# Altium schematic sheet mpc56_cwconn.SchDoc: CW308 UFO Connectors
size Letter; Organization: NewAE Technology Inc.; Address1: 1083 Queen St., Suite 196; Address2: Halifax; Address3: NS; Address4: Canada B3H 0B2; SheetNumber: 4; SheetTotal: 5; SheetApproved: YES
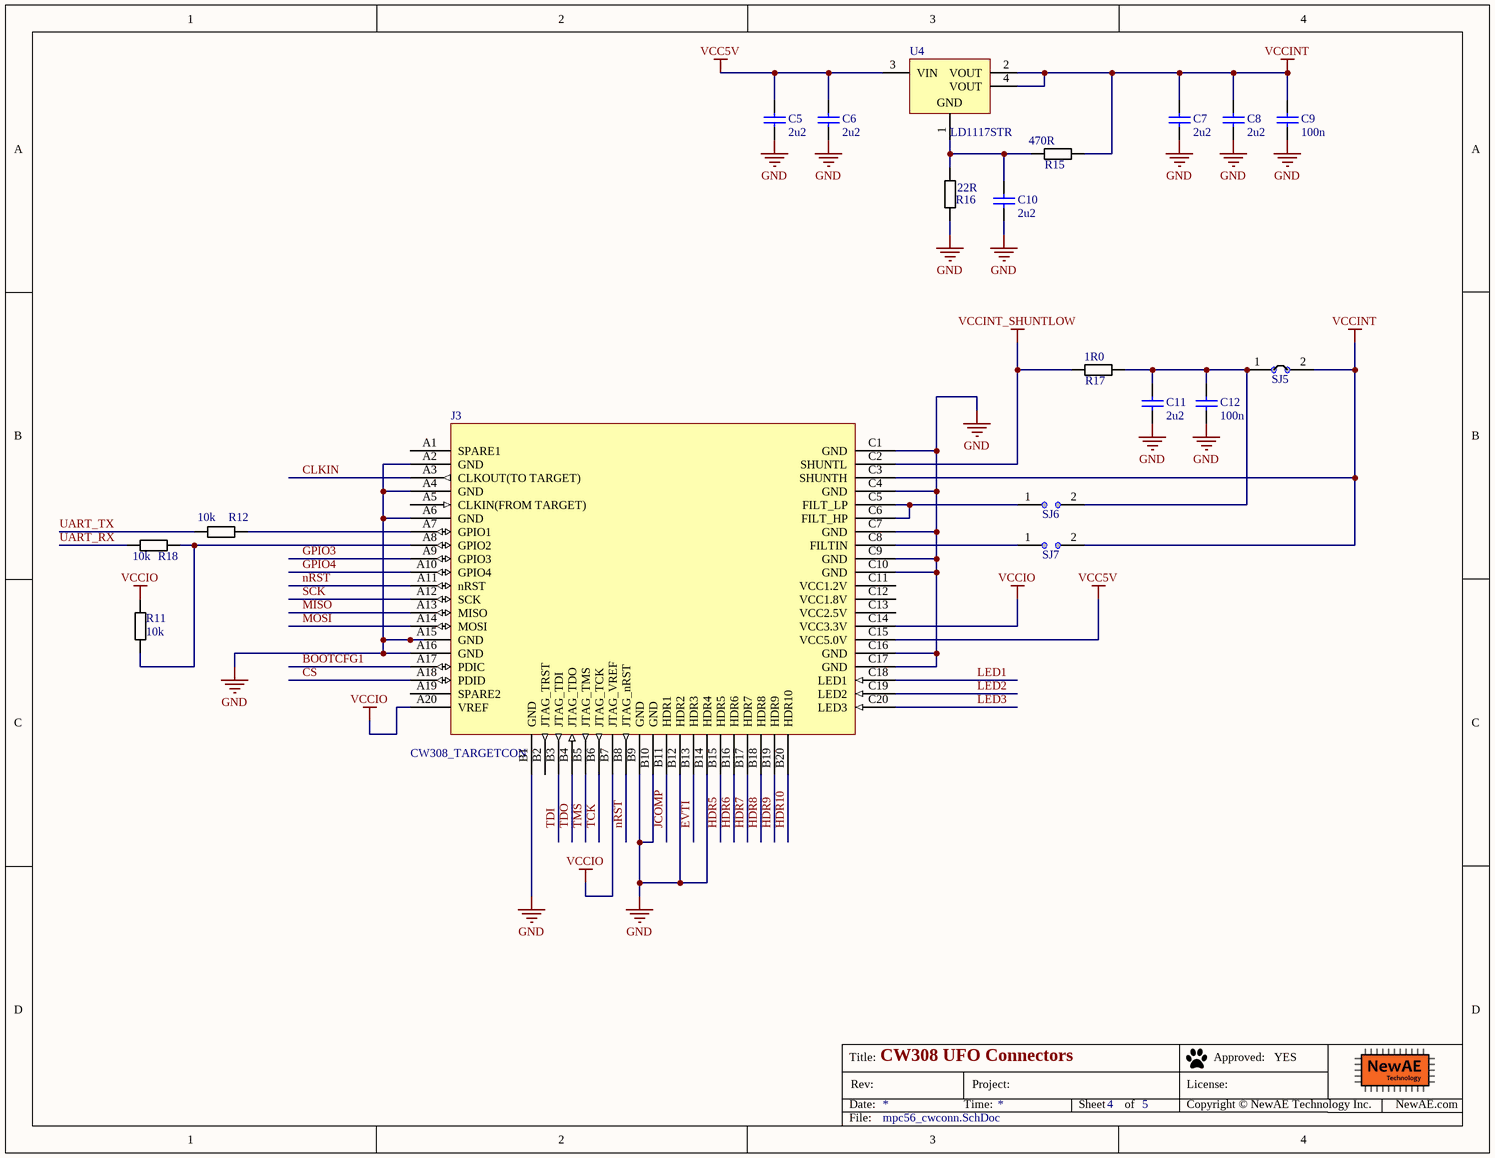
[diagram p0: mpc56_cwconn.SchDoc]

## Parts
C5  2u2  [CAPC0603_M]
C6  2u2  [CAPC0603_M]
C7  2u2  [CAPC0603_M]
C8  2u2  [CAPC0603_M]
C9  100n  [CAPC0402_M]
C10  2u2  [CAPC0603_M]
C11  2u2  [CAPC0603_M]
C12  100n  [CAPC0402_M]
J3  CW308_TARGETCON  [CW308_TBOARD_CONN]
R11  10k  [RESC1608X55N]
R12  10k  [RESC1608X55N]
R15  470R  [RESC1608X55N]
R16  22R  [RESC1608X55N]
R17  1R0  [RESC2012X70N]
R18  10k  [RESC1608X55N]
SJ5  NC  [SJ_2S_NC]  (value not drawn)  (no BOM)
SJ6  NO  [SJ_2S_NO]  (value not drawn)  (no BOM)
SJ7  NO  [SJ_2S_NO]  (value not drawn)  (no BOM)
U4  LD1117STR  [SOT-223_L]

## Nets
GND: C5.2 C6.2 C7.2 C8.2 C9.2 C10.2 C11.2 C12.2 J3.A2(GND) J3.A4(GND) J3.A6(GND) J3.A15(GND) J3.A16(GND) J3.B1(GND) J3.B9(GND) J3.B10(GND) J3.B12(HDR2) J3.B14(HDR4) J3.C1(GND) J3.C4(GND) J3.C7(GND) J3.C9(GND) J3.C10(GND) J3.C16(GND) J3.C17(GND) R16.2
VCC5V: C5.1 C6.1 J3.C15(VCC5.0V) U4.3(VIN)
VCCINT: C7.1 C8.1 C9.1 J3.C3(SHUNTH) R15.1 SJ5.2 SJ7.2 U4.2(VOUT) U4.4(VOUT)
VCCINT_SHUNTLOW: J3.C2(SHUNTL) R17.1
VCCIO: J3.A20(VREF) J3.B7(JTAG_VREF) J3.C14(VCC3.3V) R11.2
BOOTCFG1: J3.A17(PDIC)
CLKIN: J3.A3(CLKOUT(TO_TARGET))
CS: J3.A18(PDID)
EVTI: J3.B13(HDR3)
GPIO3: J3.A9(GPIO3)
GPIO4: J3.A10(GPIO4)
HDR5: J3.B15(HDR5)
HDR6: J3.B16(HDR6)
HDR7: J3.B17(HDR7)
HDR8: J3.B18(HDR8)
HDR9: J3.B19(HDR9)
HDR10: J3.B20(HDR10)
JCOMP: J3.B11(HDR1)
LED1: J3.C18(LED1)
LED2: J3.C19(LED2)
LED3: J3.C20(LED3)
MISO: J3.A13(MISO)
MOSI: J3.A14(MOSI)
nRST: J3.A11(nRST) J3.B8(JTAG_nRST)
SCK: J3.A12(SCK)
TCK: J3.B6(JTAG_TCK)
TDI: J3.B3(JTAG_TDI)
TDO: J3.B4(JTAG_TDO)
TMS: J3.B5(JTAG_TMS)
UART_RX: R18.1
UART_TX: R12.1
NetC10_1: C10.1 R15.2 R16.1 U4.1(GND)
NetC11_1: C11.1 C12.1 R17.2 SJ5.1 SJ6.2
NetJ3_A7: J3.A7(GPIO1) R12.2
NetJ3_A8: J3.A8(GPIO2) R11.1 R18.2
NetJ3_C5: J3.C5(FILT_LP) J3.C6(FILT_HP) SJ6.1
NetJ3_C8: J3.C8(FILTIN) SJ7.1

Not connected (* = marked no-connect by the designer): J3 A1(SPARE1) A5(CLKIN(FROM_TARGET)) A19(SPARE2) B2(JTAG_TRST) C11(VCC1.2V) C12(VCC1.8V) C13(VCC2.5V)

## Notes on the sheet
- Title:
- Date:
- Rev:
- Time:
- Project:
- Sheet
- of
- License:
- Copyright © NewAE Technology Inc.
- Approved:
- NewAE.com
- File:

## Library data of the parts
C5-C8 C10 C11 = CCHIP-2u2-0603: 2u2, 0603; Case-EIA: 0603; Case-Metric: 1608; Part Number: CCHIP-2u2-0603; Component Kind: Standard; Component Type: Standard; Footprint: 0603; Pin Count: 2; Value: 2u2; Mounting Technology: SMT
C9 C12 = CCHIP-100n-0402: 100n, 0402; Case-EIA: 0402; Part Number: CCHIP-100n-0402; Component Kind: Standard; Component Type: Standard; Footprint: 0402; Pin Count: 2; Value: 100n; Mounting Technology: SMT
J3 = CW308_TBOARD: CW308 "Standard" Target Board Connector
R11 R12 R18 = RCHIP-10K-0603: 10k res, 0603, 1%, 1/10W; Manufacture 1: Yageo; Manufacture Part Number 1: RC0603FR-0710KL; Case-EIA: 0603; Case-Metric: 1608; Rated Power: 0.1W; Rated Voltage: 75VDC; Part Number: RCHIP-10K-0603; Component Kind: Standard; Component Type: Standard; Footprint: 0603; Pin Count: 2; Supplier 1: Digi-Key; Supplier Part Number 1: 311-10.0KHRCT-ND; Value: 10k; Tolerance: 1%; Mounting Technology: SMT; Temperature Range: -55C to 155C
R15 = RCHIP-120R-0603: 470R res, 0603, 1%, 1/10W; Manufacture 1: Yageo; Manufacture Part Number 1: RC0603FR-07470RL; Case-EIA: 0603; Case-Metric: 1608; Rated Power: 0.1W; Rated Voltage: 75VDC; Part Number: RCHIP-120R-0603; Component Kind: Standard; Component Type: Standard; Footprint: 0603; Pin Count: 2; Supplier 1: Digi-Key; Supplier Part Number 1: 311-470HRCT-ND; Value: 470R; Tolerance: 1%; Mounting Technology: SMT; Temperature Range: -55C to 155C
R16 = RCHIP-120R-0603: 120R res, 0603, 1%, 1/10W; Manufacture 1: Yageo; Manufacture Part Number 1: RC0603FR-0722RL; Case-EIA: 0603; Case-Metric: 1608; Rated Power: 0.1W; Rated Voltage: 75VDC; Part Number: RCHIP-120R-0603; Component Kind: Standard; Component Type: Standard; Footprint: 0603; Pin Count: 2; Supplier 1: Digi-Key; Supplier Part Number 1: 311-22HRCT-ND; Value: 22R; Tolerance: 1%; Mounting Technology: SMT; Temperature Range: -55C to 155C
R17 = RCHIP-1R0-0805: 1R0 res, 0805, 1%, 1/8W; Manufacture 1: Yageo; Manufacture Part Number 1: RC0805FR-071RL; Case-EIA: 0805; Rated Power: 0.125W; Rated Voltage: 75VDC; Part Number: RCHIP-1R0-0805; Component Kind: Standard; Component Type: Standard; Footprint: 0805; Pin Count: 2; Supplier 1: Digi-Key; Supplier Part Number 1: 311-1.00CRCT-ND; Value: 1R0; Tolerance: 1%; Mounting Technology: SMT; Temperature Range: -55C to 155C
SJ5 = SJ_2S: Solder Jumper, NC; Part Number: SJ_2S; Component Type: Standard (No BOM); Pin Count: 2
SJ6 SJ7 = SJ_2S_NO: Solder Jumper, NO; Part Number: SJ_2S_NO; Component Type: Standard (No BOM); Pin Count: 2; Mounting Technology: COPPER
U4 = CMP-0244-00313-1: Adjustable Low Drop Voltage Regulator, 1.25 to 15V, 4-Pin SOT-223, Tape and Reel; ComponentLink2Description: Datasheet; PackageVersion: 2010; PackageReference: SOT-223; ComponentLink2URL: http://www.st.com/internet/com/TECHNICAL_RESOURCES/TECHNICAL_LITERATURE/DATASHEET/CD00000544.pdf; DatasheetVersion: 1/11/2011; ComponentLink1URL: http://www.st.com; PackageDescription: 4-Pin SOT-223 Package, 6.5 x 3.5 mm Body, 2.3 mm Pitch, 7 mm Lead Span; ComponentLink1Description: Manufacturer URL; Supplier 1: Digi-Key; Supplier Part Number 1: 497-1244-1-ND